# EAGLE design AC-DC (EAGLE 9.5.2)
Assembly variants: NoPCB
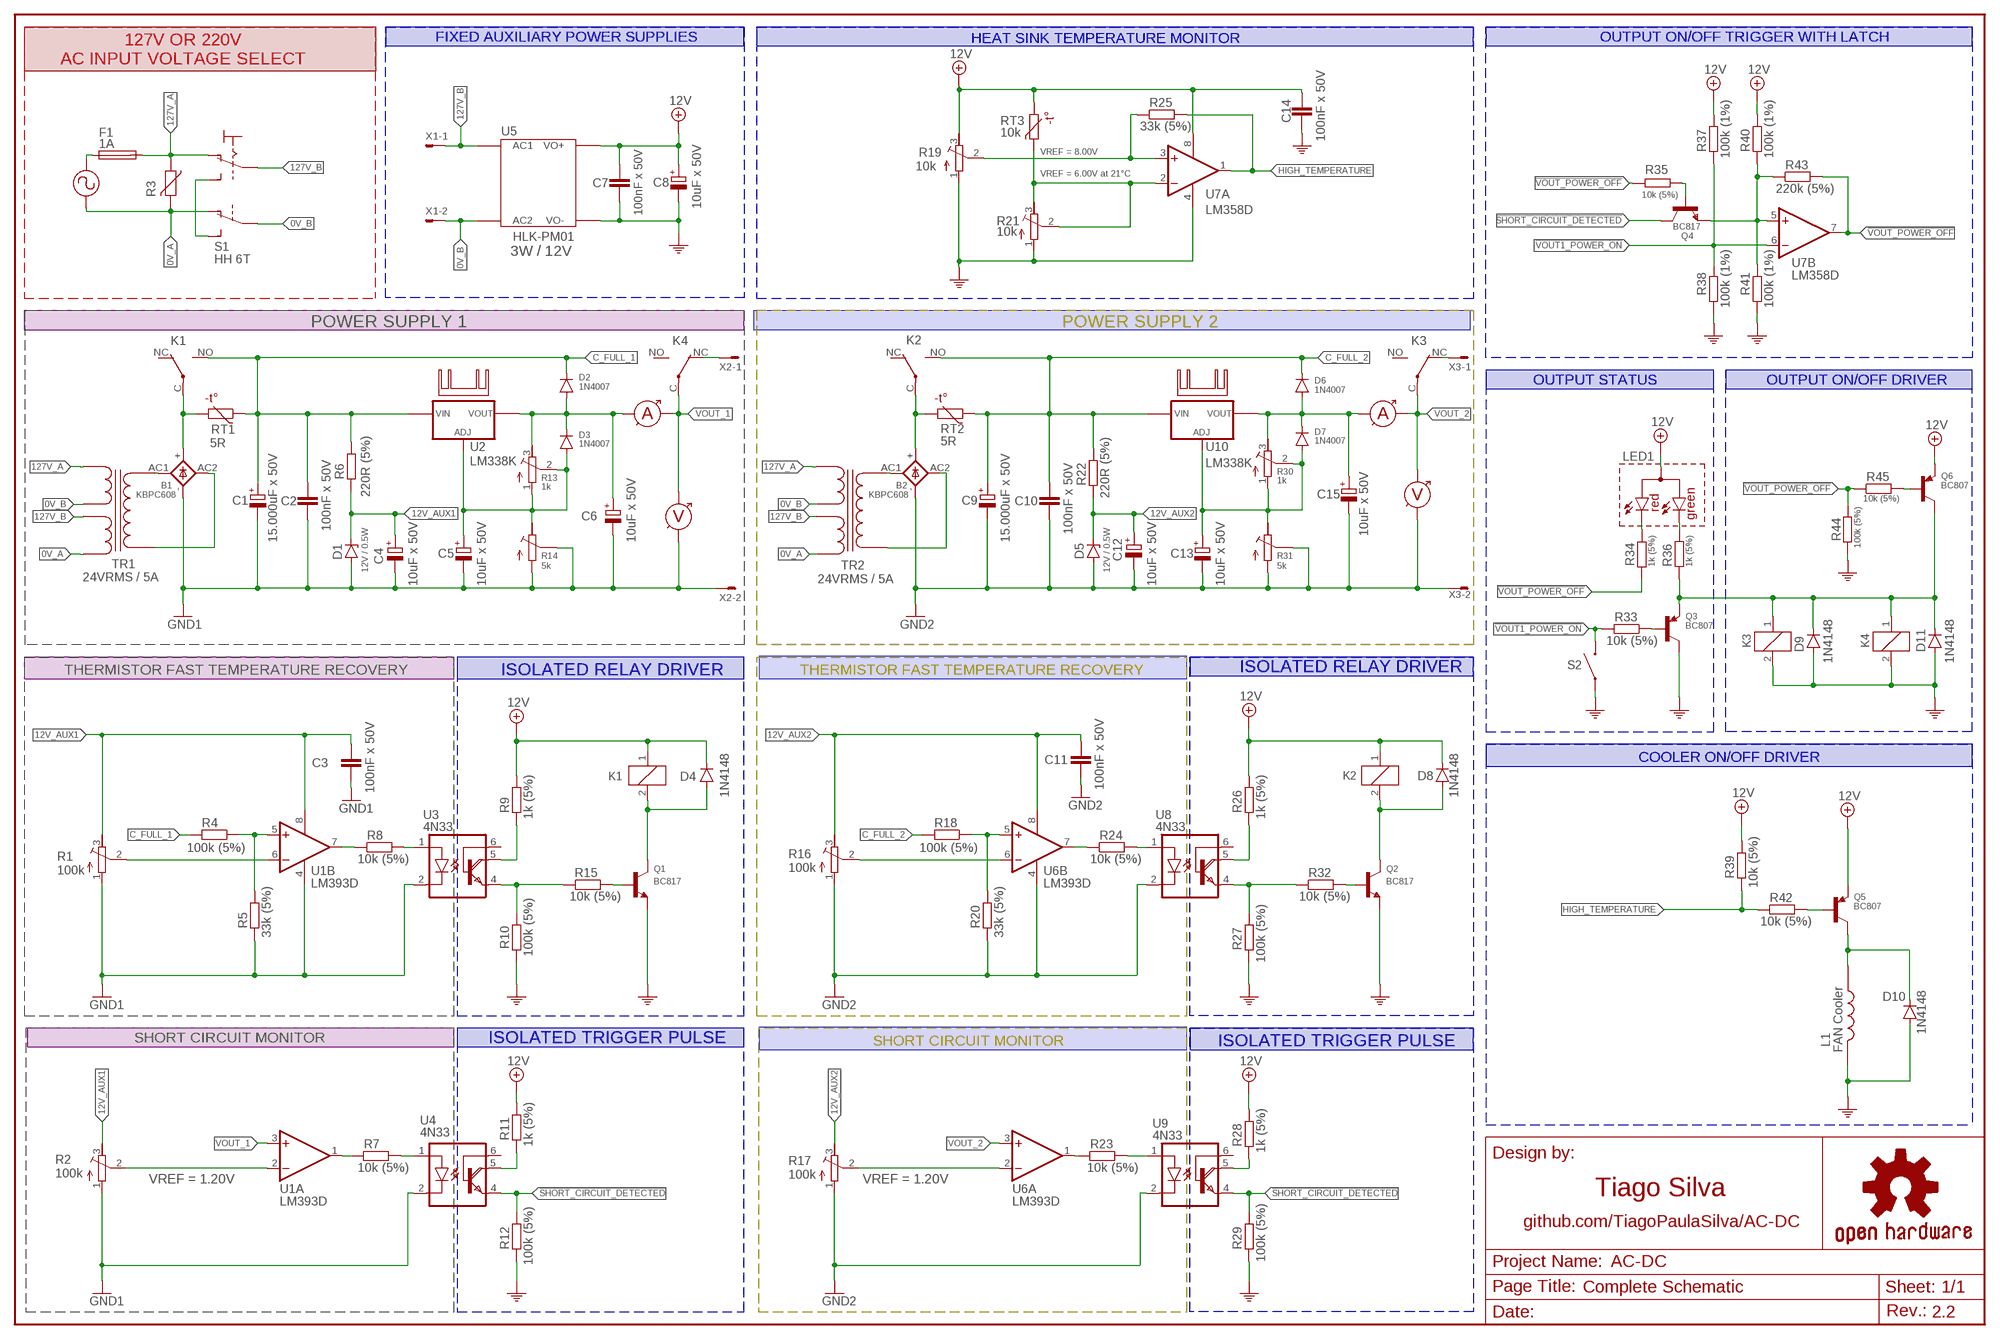
[diagram p0: schematic, sheet 1]

## Parts
AMP1  AMMETER  [AMMETER]
AMP2  AMMETER  [AMMETER]
B1  KBPC608  GBPC1  [GBPC1]
B2  KBPC608  GBPC1  [GBPC1]
C1  15.000uF x 50V  CPOL-EUE10-35  [EB35D]
C2  100nF x 50V  C-EUC0805  [C0805]
C3  100nF x 50V  C-EUC0805  [C0805]
C4  10uF x 50V  CPOL-EU153CLV-0605  [153CLV-0605]
C5  10uF x 50V  CPOL-EU153CLV-0605  [153CLV-0605]
C6  10uF x 50V  CPOL-EU153CLV-0605  [153CLV-0605]
C7  100nF x 50V  C-EUC0805  [C0805]
C8  10uF x 50V  CPOL-EU153CLV-0605  [153CLV-0605]
C9  15.000uF x 50V  CPOL-EUE10-35  [EB35D]
C10  100nF x 50V  C-EUC0805  [C0805]
C11  100nF x 50V  C-EUC0805  [C0805]
C12  10uF x 50V  CPOL-EU153CLV-0605  [153CLV-0605]
C13  10uF x 50V  CPOL-EU153CLV-0605  [153CLV-0605]
C14  100nF x 50V  C-EUC0805  [C0805]
C15  10uF x 50V  CPOL-EU153CLV-0605  [153CLV-0605]
D1  12V / 0.5W  ZENER-DIODESOD80C  [SOD80C]
D2  1N4007  CGRM4007-G  [SOD-123_MINI-SMA]
D3  1N4007  CGRM4007-G  [SOD-123_MINI-SMA]
D4  1N4148  DIODE-SOD80C  [SOD80C]
D5  12V / 0.5W  ZENER-DIODESOD80C  [SOD80C]
D6  1N4007  CGRM4007-G  [SOD-123_MINI-SMA]
D7  1N4007  CGRM4007-G  [SOD-123_MINI-SMA]
D8  1N4148  DIODE-SOD80C  [SOD80C]
D9  1N4148  DIODE-SOD80C  [SOD80C]
D10  1N4148  DIODE-SOD80C  [SOD80C]
D11  1N4148  DIODE-SOD80C  [SOD80C]
F1  1A  FUSE  (no package)
G1  GENERATOR  (no package)
K1  CQ1-12V  [CQ1]
K2  CQ1-12V  [CQ1]
K3  CQ1-12V  [CQ1]
K4  CQ1-12V  [CQ1]
L1  FAN Cooler  MOTOR  [MOLEX-2P]
LED1  LED-BICOLOR-MOLEX3P  [MOLEX3P]
Q1  BC817  BC848SMD  [SOT23]
Q2  BC817  BC848SMD  [SOT23]
Q3  BC807  BC858BSMD  [SOT23-BEC]
Q4  BC817  BC848BSMD  [SOT23]
Q5  BC807  BC858BSMD  [SOT23-BEC]
Q6  BC807  BC858BSMD  [SOT23-BEC]
R1  100k  R-TRIMM3202  [RTRIM3202]
R2  100k  R-TRIMM3202  [RTRIM3202]
R3  VARISTOR  (no package)
R4  100k (5%)  R-EU_R0805  [R0805]
R5  33k (5%)  R-EU_R0805  [R0805]
R6  220R (5%)  R-EU_R2512  [R2512]
R7  10k (5%)  R-EU_R0805  [R0805]
R8  10k (5%)  R-EU_R0805  [R0805]
R9  1k (5%)  R-EU_R0805  [R0805]
R10  100k (5%)  R-EU_R0805  [R0805]
R11  1k (5%)  R-EU_R0805  [R0805]
R12  100k (5%)  R-EU_R0805  [R0805]
R13  1k  R-TRIMM3202  [RTRIM3202]
R14  5k  R-TRIMM  [MOLEX3P]
R15  10k (5%)  R-EU_R0805  [R0805]
R16  100k  R-TRIMM3202  [RTRIM3202]
R17  100k  R-TRIMM3202  [RTRIM3202]
R18  100k (5%)  R-EU_R0805  [R0805]
R19  10k  R-TRIMM3202  [RTRIM3202]
R20  33k (5%)  R-EU_R0805  [R0805]
R21  10k  R-TRIMM3202  [RTRIM3202]
R22  220R (5%)  R-EU_R2512  [R2512]
R23  10k (5%)  R-EU_R0805  [R0805]
R24  10k (5%)  R-EU_R0805  [R0805]
R25  33k (5%)  R-EU_R0805  [R0805]
R26  1k (5%)  R-EU_R0805  [R0805]
R27  100k (5%)  R-EU_R0805  [R0805]
R28  1k (5%)  R-EU_R0805  [R0805]
R29  100k (5%)  R-EU_R0805  [R0805]
R30  1k  R-TRIMM3202  [RTRIM3202]
R31  5k  R-TRIMM  [MOLEX3P]
R32  10k (5%)  R-EU_R0805  [R0805]
R33  10k (5%)  R-EU_R0805  [R0805]
R34  1k (5%)  R-EU_R0805  [R0805]
R35  10k (5%)  R-EU_R0805  [R0805]
R36  1k (5%)  R-EU_R0805  [R0805]
R37  100k (1%)  R-EU_R0805  [R0805]
R38  100k (1%)  R-EU_R0805  [R0805]
R39  10k (5%)  R-EU_R0805  [R0805]
R40  100k (1%)  R-EU_R0805  [R0805]
R41  100k (1%)  R-EU_R0805  [R0805]
R42  10k (5%)  R-EU_R0805  [R0805]
R43  220k (5%)  R-EU_R0805  [R0805]
R44  100k (5%)  R-EU_R0805  [R0805]
R45  10k (5%)  R-EU_R0805  [R0805]
RT1  5R  NTC-11MM  [11MM]
RT2  5R  NTC-11MM  [11MM]
RT3  10k  NTC-MOLEX2P  [MOLEX2P]
S1  HH 6T  320-938  (no package)
S2  SWITCH-MOLEX2P  [MOLEX-2P]
TR1  24VRMS / 5A  TRAFO  [2PINS]
TR2  24VRMS / 5A  TRAFO  [2PINS]
U1  LM393D  [SO08]
U2  LM338K  LM338K-MOLEX  [MOLEX3P]
U3  4N33  [DIL6-SMD]
U4  4N33  [DIL6-SMD]
U5  HLK-PM01  [HLK-PM01]
U6  LM393D  [SO08]
U7  LM358D  [SO08]
U8  4N33  [DIL6-SMD]
U9  4N33  [DIL6-SMD]
U10  LM338K  LM338K-MOLEX  [MOLEX3P]
VOLT1  VOLTMETER  [VOLTMETER]
VOLT2  VOLTMETER  [VOLTMETER]
X1  22-23-2021  [22-23-2021]
X2  22-23-2021  [22-23-2021]
X3  22-23-2021  [22-23-2021]

## Nets
0V_A: G1.P$2 R3.2 S1.O
0V_B: S1.P U5.P$2(AC2) X1.2
12V_AUX1: C3.1 C4.+ D1.C R1.3(E) R2.3(E) R6.1 U1.8(P:V+) VOLT1.P$1
12V_AUX2: C11.1 C12.+ D5.C R16.3(E) R17.3(E) R22.1 U6.8(P:V+) VOLT2.P$1
127V_A: F1.2 R3.1 S1.O
127V_B: S1.P U5.P$1(AC1) X1.1
!SHORT_CIRCUIT_DETECTED!: Q4.3(C) R12.2 R29.2 U4.4(E) U9.4(E)
!VOUT1_POWER_ON!: R33.2 R37.1 R38.2 S2.P$2 U7.6(B:-IN)
!VOUT1_POWER_ON!1: R11.1 U4.5(COL)
!VOUT1_POWER_ON!2: R9.1 U3.5(COL)
!VOUT1_POWER_ON!3: R28.1 U9.5(COL)
!VOUT1_POWER_ON!4: R26.1 U8.5(COL)
!VOUT_POWER_OFF!: R34.2 R35.1 R43.2 R44.1 R45.1 U7.7(B:OUT)
+12V: C7.1 C8.+ C14.1 D4.C D8.C K1.1 K2.1 LED1.P$1(A) Q5.E Q6.E R9.2 R11.2 R19.3(E) R26.2 R28.2 R37.2 R39.2 R40.2 RT3.P$2 U5.P$4(VO+) U7.8(P:V+) ; supply symbol labelled 12V
C_FULL_1: C1.+ C2.1 D2.C K1.NO(2:S) R4.2 R6.2 RT1.P$1 U2.1(VIN)
C_FULL_2: C9.+ C10.1 D6.C K2.NO(2:S) R18.2 R22.2 RT2.P$1 U10.1(VIN)
GND1: B1.- C1.- C2.2 C3.2 C4.- C5.- C6.- D1.A R1.1(A) R2.1(A) R5.1 R14.P$1(A) R14.P$3(S) U1.4(P:V-) U3.2(C) U4.2(C) VOLT1.P$2 X2.2
GND2: B2.- C9.- C10.2 C11.2 C12.- C13.- C15.- D5.A R16.1(A) R17.1(A) R20.1 R31.P$1(A) R31.P$3(S) U6.4(P:V-) U8.2(C) U9.2(C) VOLT2.P$2 X3.2
HIGH_TEMPERATURE: R25.2 R39.1 R42.1 U7.1(A:OUT)
N$1: B1.+ K1.C(2:P) RT1.P$2
N$2: D4.A K1.2 Q1.3(C)
N$3: LED1.P$3(CR) R34.1
N$4: Q1.1(B) R15.2
N$5: R17.2(S) U6.2(A:-IN)
N$6: R1.2(S) U1.6(B:-IN)
N$7: Q6.B R45.2
N$8: F1.1 G1.P$3
N$9: S1.S
N$10: B1.AC1 TR1.1
N$11: B1.AC2 TR1.2
N$12: D9.C D11.C K3.1 K4.1 Q3.E Q6.C R36.1
N$13: LED1.P$2(CG) R36.2
N$14: Q3.B R33.1
N$15: AMP1.2 C6.+ D2.A D3.C R13.3(E) U2.3(VOUT)
N$16: C5.+ D3.A R13.1(A) R13.2(S) R14.P$2(E) U2.2(GND)
N$17: K4.NC(2:O) X2.1
N$18: R4.1 R5.2 U1.5(B:+IN)
N$19: R7.1 U1.1(A:OUT)
N$20: R7.2 U4.1(A)
N$21: Q4.2(E) R40.1 R41.2 R43.1 U7.5(B:+IN)
N$22: Q4.1(B) R35.2
N$23: B2.AC1 TR2.1
N$24: B2.AC2 TR2.2
N$25: R2.2(S) U1.2(A:-IN)
N$26: AMP2.2 C15.+ D6.A D7.C R30.3(E) U10.3(VOUT)
N$27: C13.+ D7.A R30.1(A) R30.2(S) R31.P$2(E) U10.2(GND)
N$28: K3.NC(2:O) X3.1
N$29: B2.+ K2.C(2:P) RT2.P$2
N$32: Q5.B R42.2
N$33: D8.A K2.2 Q2.3(C)
N$35: R21.2(S) R21.3(E) RT3.P$1 U7.2(A:-IN)
N$36: R19.2(S) R25.1 U7.3(A:+IN)
N$37: R8.1 U1.7(B:OUT)
N$38: D10.C L1.P$1 Q5.C
N$39: R8.2 U3.1(A)
N$40: Q2.1(B) R32.2
N$41: R18.1 R20.2 U6.5(B:+IN)
N$42: R23.1 U6.1(A:OUT)
N$43: R16.2(S) U6.6(B:-IN)
N$44: R23.2 U9.1(A)
N$45: R24.1 U6.7(B:OUT)
N$46: R24.2 U8.1(A)
N$47: R27.2 R32.1 U8.4(E)
N$48: R10.2 R15.1 U3.4(E)
PE: C7.2 C8.- C14.2 D9.A D10.A D11.A K3.2 K4.2 L1.P$2 Q1.2(E) Q2.2(E) Q3.C R10.1 R12.1 R19.1(A) R21.1(A) R27.1 R29.1 R38.1 R41.1 R44.2 S2.P$1 U5.P$3(VO-) U7.4(P:V-)
VOUT_1: AMP1.1 K4.C(2:P) U1.3(A:+IN) VOLT1.P$3
VOUT_2: AMP2.1 K3.C(2:P) U6.3(A:+IN) VOLT2.P$3
Unconnected: K1.NC(2:O) K2.NC(2:O) K3.NO(2:S) K4.NO(2:S) U3.6(B) U4.6(B) U8.6(B) U9.6(B)

## Notes on the sheet
- FIXED AUXILIARY POWER SUPPLIES | OUTPUT ON/OFF TRIGGER WITH LATCH
- HEAT SINK TEMPERATURE MONITOR
- 127V OR 220V
  AC INPUT VOLTAGE SELECT
- VREF = 8.00V
- VREF = 6.00V at 21°C
- 3W / 12V
- POWER SUPPLY 1 | POWER SUPPLY 2
- OUTPUT STATUS | OUTPUT ON/OFF DRIVER
- THERMISTOR FAST TEMPERATURE RECOVERY | THERMISTOR FAST TEMPERATURE RECOVERY | ISOLATED RELAY DRIVER
- ISOLATED RELAY DRIVER
- COOLER ON/OFF DRIVER
- SHORT CIRCUIT MONITOR | SHORT CIRCUIT MONITOR
- ISOLATED TRIGGER PULSE | ISOLATED TRIGGER PULSE
- VREF = 1.20V | VREF = 1.20V
- Tiago Silva
- github.com/TiagoPaulaSilva/AC-DC
- Complete Schematic
- 2.2

## Library data of the parts
AMP1 AMP2 = Instrumentos:AMMETER
B1 B2 = rectifier:GBPC1: GENERAL INSTRUMENT RECTIFIER
C1 C4-C6 C8 C9 C12 C13 C15 = rcl:CPOL-EU: POLARIZED CAPACITOR, European symbol; SPICEPREFIX: C
C2 C3 C7 C10 C11 C14 = rcl:C-EU: CAPACITOR, European symbol; SPICEPREFIX: C
D1 D5 = diode:ZENER-DIODE: Z-Diode
D2 D3 D6 D7 = diode:CGRM400*-G: Molded plasitc,JEDEC SOD-123/Mini SMA Source: Comchip CGRM4001-G.pdf
D4 D8-D11 = diode:DIODE-: DIODE
F1 = fuse-no-footprint:FUSE: Fuse; _EXTERNAL_: _EXTERNAL_
G1 = Instrumentos:GENERATOR; _EXTERNAL_: _EXTERNAL_
K1-K4 = relay:CQ1-12V: AUTOMOTIVE QUIET RELAY NAiS Source: http://www.mew-europe.com/.. en_ds_61208_0000.pdf; OC_FARNELL: unknown; OC_NEWARK: unknown
L1 = Inductor:MOTOR
LED1 = led:LED-BICOLOR-MOLEX3P
Q1 Q2 Q4 = transistor-npn:BC848*: NPN Transistor
Q3 Q5 Q6 = transistor-pnp:BC858*: PNP Transistror
R1 R2 R13 R16 R17 R19 R21 R30 = rcl:R-TRIMM: Trimm resistor; SPICEMODEL: X; SPICEPREFIXL: POT
R3 = varistor:VARISTOR: VARISTOR; _EXTERNAL_: _EXTERNAL_
R4-R12 R15 R18 R20 R22-R29 R32-R45 = rcl:R-EU_: RESISTOR, European symbol; SPICEPREFIX: R
R14 R31 = trimpot-molex2p:R-TRIMM: Trimm resistor
RT1 RT2 = ptc-ntc:NTC-11MM
RT3 = ptc-ntc:NTC-MOLEX2P
S1 = switch-HH-NO-MODEL:320-938: TOGGLE SWITCH distributor RS Components; _EXTERNAL_: _EXTERNAL_
S2 = switch-MOLEX2:SWITCH-MOLEX2P
TR1 TR2 = Trafo:TRAFO; _EXTERNAL_: _EXTERNAL_
U1 U6 = linear:LM393: COMPARATOR
U2 U10 = REG1117:LM338K-MOLEX
U3 U4 U8 U9 = optocoupler:4N33: MOTOROLA OPTO COUPLER
U5 = HLK-PM01:HLK-PM01: HI-LINK Ultra-compact power module HLK-PM01 Meet UL, CE requirements Ultra-thin, ultra-small All voltage input (AC: 90 ~ 264V) Low ripple and low noise Output overload and short circuit protection High efficiency, high power density The product is designed to meet the requirements of EMC and Safety Test Low power consumption, environmental protection, no-load loss <0.1W 100% load aging and testing; AVAILABILITY: Unavailable; MF: Hi-link; MP: hlk-pm01; PACKAGE: Package Analog Devices; PRICE: None
U7 = linear:LM358: OP AMP also LM158; LM258; LM2904 Source: http://cache.national.com/ds/LM/LM158.pdf
VOLT1 VOLT2 = Instrumentos:VOLTMETER
X1-X3 = con-molex-PTR:22-23-2021: .100" (2.54mm) Center Header - 2 Pin; MF: MOLEX; MPN: 22-23-2021; OC_FARNELL: 1462926; OC_NEWARK: 25C3832

## Board
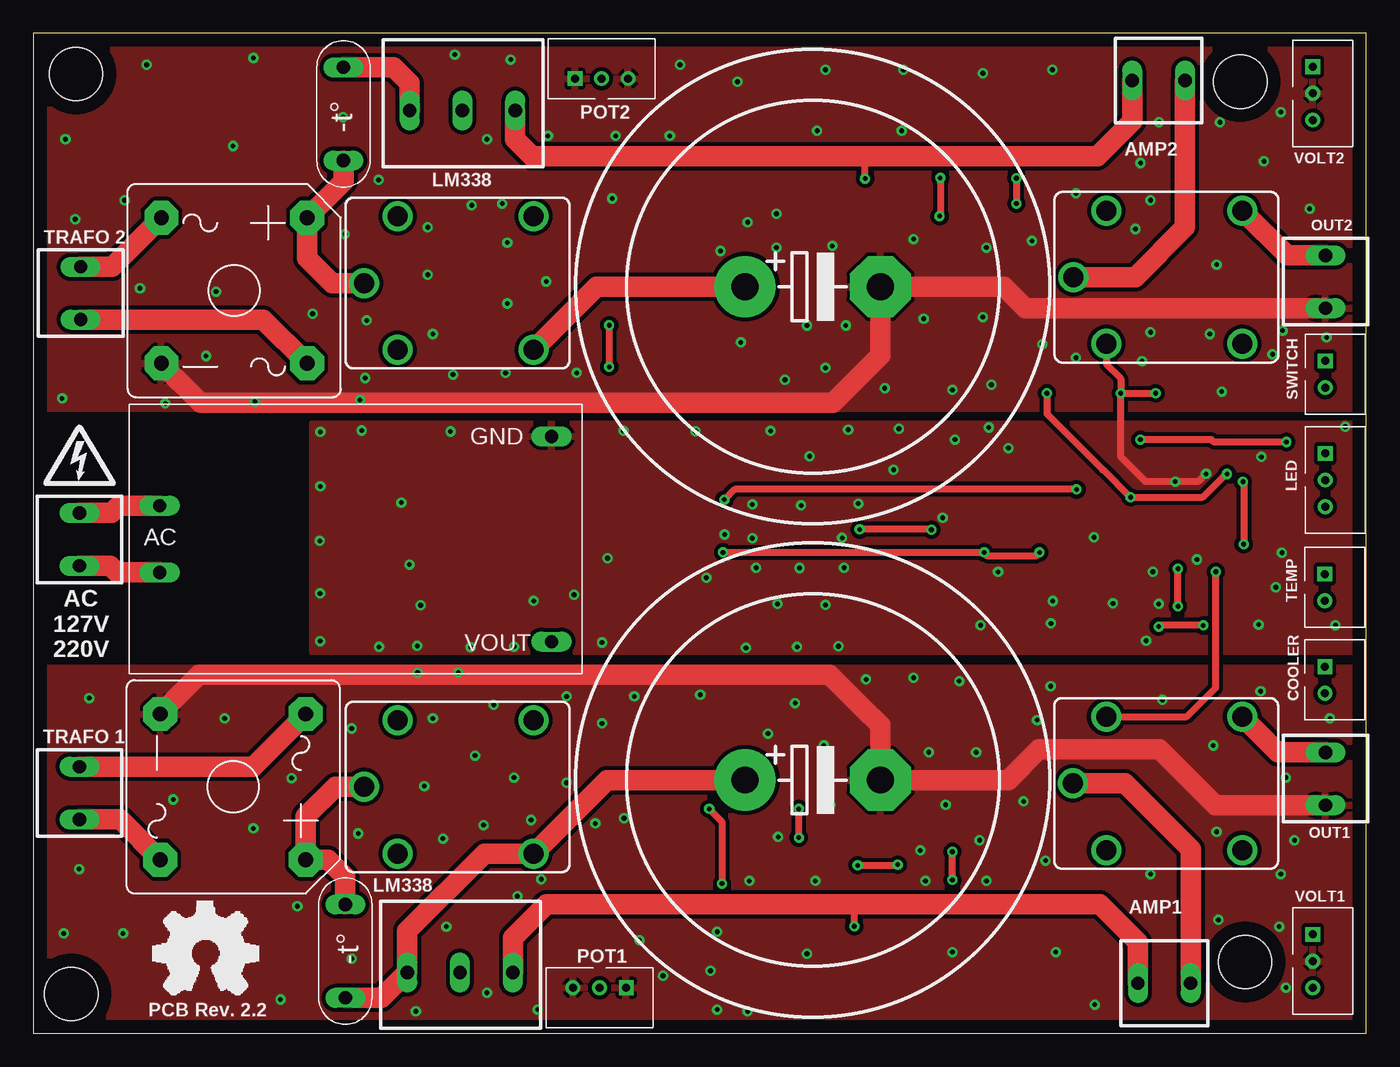
[diagram p1: board, top side]
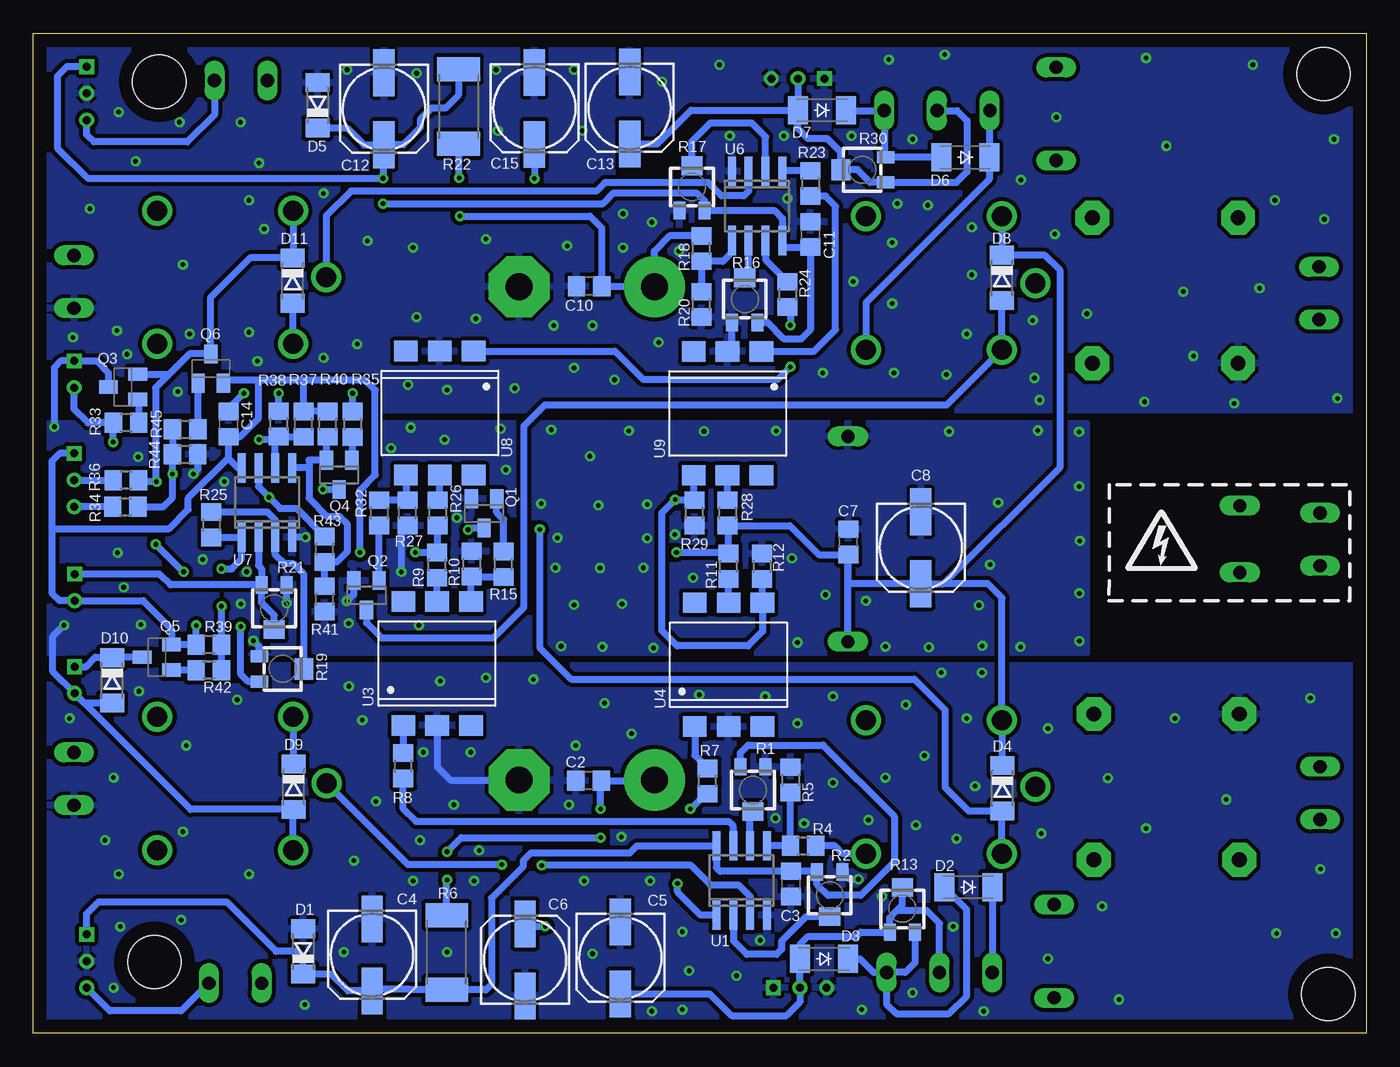
[diagram p2: board, bottom side, seen from below]

Size 100 x 75 mm. Coordinates in mm from the lower left corner, seen from the top.
Outline: 0,0 100,0 100,75 0,75 0,0
Copper layers (1*16): Top 0.035mm / dielectric 1.5mm / Bottom 0.035mm
Design rules "default *": minimum track width 20mil, minimum drill 0.35mm, track to track 12mil, track to pad 12mil, pad to pad 12mil, via to via 12mil, smd to smd 12mil, copper to edge 40mil, drill to drill 6mil, minimum pad ring 10mil, minimum via ring 8mil, stop-mask expansion 4mil, vias tented up to drill 0mil, thermal gap 10mil
Holes 4 mm at 90.55,71.37 2.84,2.95 3.2,71.96 90.91,5.36

### Footprints (pad centres in the part's own frame; a part is rotated, then mirrored left to right if it is on the bottom)
AMMETER = drill 1 long: 1 0,0; 2 3.96,0
GBPC1 = drill 1.118 pad 2.54 octagon: + 5.461,5.461; - -5.461,-5.461; AC1 -5.461,5.461; AC2 5.461,-5.461
EB35D = drill 2.007 pad 4.597: + -5.08,0 | drill 2.007 pad 4.597 octagon: - 5.08,0
C0805 = smd 1.3 x 1.5: 1 -0.95,0; 2 0.95,0
153CLV-0605 = smd 3.5 x 1.6: + 2.7,0; - -2.7,0
SOD80C = smd 1.4 x 1.8: A 1.7,0; C -1.7,0
SOD-123_MINI-SMA = smd 1.5 x 2.1: A 1.8,0; C -1.8,0
CQ1 = drill 1.5: 1 4.5,-5; 2 4.5,5; C 7,0; NC -5.7,-5; NO -5.7,5
MOLEX-2P = drill 0.6 square: P$1 0,0 | drill 0.6: P$2 2,0
MOLEX3P = drill 0.6 square: P$1 0,0 | drill 0.6: P$2 2,0; P$3 4,0
SOT23 = smd 1 x 1.4: 1 -0.95,-1.1; 2 0.95,-1.1; 3 0,1.1
SOT23-BEC = smd 1 x 1.4: B -0.95,-1.1; C 0,1.1; E 0.95,-1.1
RTRIM3202 = smd 0.9 x 1.3: 1 -0.95,-1.75; 3 0.95,-1.75 | smd 1.6 x 1.4: 2 0,1.6
R0805 = smd 1.3 x 1.5: 1 -0.95,0; 2 0.95,0
R2512 = smd 1.8 x 3.2: 1 -2.8,0; 2 2.8,0
11MM = drill 1 long: P$1 0,0; P$2 7,0
MOLEX2P = drill 0.6 square: P$1 0,0 | drill 0.6: P$2 2,0
2PINS = drill 1 long: 1 0,0; 2 3.96,0
SO08 = smd 0.6 x 2.2: 1 -1.905,-2.6; 2 -0.635,-2.6; 3 0.635,-2.6; 4 1.905,-2.6; 5 1.905,2.6; 6 0.635,2.6; 7 -0.635,2.6; 8 -1.905,2.6
MOLEX3P' = drill 1 long: 1 2.009,4.191; 2 5.969,4.191; 3 9.929,4.191
DIL6-SMD = smd 1.78 x 1.52: 1 -2.54,-4.645; 2 0,-4.645; 3 2.54,-4.645; 4 2.54,4.645; 5 0,4.645; 6 -2.54,4.645
HLK-PM01 = drill 1 long: P$1 -14.7,2.5; P$2 -14.7,-2.5; P$3 14.7,7.7; P$4 14.7,-7.7
VOLTMETER = drill 0.6 square: P$1 0,0 | drill 0.6: P$2 2,0; P$3 4,0
22-23-2021 = drill 1 long: 1 0,0; 2 3.96,0

### Placement (x,y rotation side)
AMP1  86.83,3.76 180 top
AMP2  86.41,71.45 180 top
B1  14.98,18.49 270 top
B2  15.07,55.71 0 top
C1  58.48,19 0 top
C2  58.34,18.96 180 bottom
C3  43.15,11.2 270 bottom
C4  74.59,5.88 270 bottom
C5  55.96,5.65 270 bottom
C6  63.11,5.51 90 bottom
C7  38.86,36.86 90 bottom
C8  33.41,36.42 270 bottom
C9  58.48,56 0 top
C10  58.29,56.05 180 bottom
C11  41.69,59.92 90 bottom
C12  73.7,69.34 270 bottom
C13  55.26,69.41 270 bottom
C14  85.34,45.69 90 bottom
C15  62.41,69.37 270 bottom
D1  79.74,6.15 90 bottom
D2  29.86,10.96 180 bottom
D3  40.68,5.58 180 bottom
D4  27.29,18.38 270 bottom
D5  78.68,69.61 90 bottom
D6  30.07,65.7 180 bottom
D7  40.84,69.23 180 bottom
D8  27.33,56.65 270 bottom
D9  80.45,18.49 270 bottom
D10  94.09,26.47 270 bottom
D11  80.53,56.45 270 bottom
K1  31.83,18.49 180 top
K2  31.83,56.27 180 top
K3  85.02,56.71 180 top
K4  84.99,18.75 180 top
L1  96.91,27.5 270 top
LED1  96.92,43.49 270 top
Q1  66.18,38.99 180 bottom
Q2  75.01,32.85 180 bottom
Q3  93.27,48.48 90 bottom
Q4  77.05,41.88 180 bottom
Q5  90.73,28.21 90 bottom
Q6  86.68,49.86 0 bottom
R1  46.01,18.25 180 bottom
R2  40.25,10.35 180 bottom
R4  42.24,14.06 0 bottom
R5  43.18,19.01 270 bottom
R6  68.99,6.06 90 bottom
R7  49.4,18.92 90 bottom
R8  72.24,20.07 90 bottom
R9  69.7,35.12 90 bottom
R10  67.12,35.2 270 bottom
R11  47.83,35.03 90 bottom
R12  45.34,35.03 270 bottom
R13  34.8,9.33 0 bottom
R14  44.48,3.42 180 top
R15  64.71,35.18 90 bottom
R16  46.62,55.07 0 bottom
R17  50.58,63.47 0 bottom
R18  49.87,58.85 90 bottom
R19  81.29,27.33 270 bottom
R20  49.87,54.67 90 bottom
R21  81.93,31.88 180 bottom
R22  68.1,69.52 270 bottom
R23  41.69,63.74 270 bottom
R24  43.41,55.42 270 bottom
R25  86.64,38.14 270 bottom
R26  69.68,39.03 270 bottom
R27  71.92,39.03 90 bottom
R28  47.92,39.03 270 bottom
R29  50.41,39.03 90 bottom
R30  37.81,64.77 90 bottom
R31  40.64,71.61 0 top
R32  74.05,39.03 270 bottom
R33  93.04,45.78 180 bottom
R34  93.09,39.48 0 bottom
R35  76.05,45.68 270 bottom
R36  93.05,41.47 180 bottom
R37  79.72,45.69 90 bottom
R38  81.58,45.71 270 bottom
R39  86.83,29.16 180 bottom
R40  77.9,45.69 90 bottom
R41  78.13,32.58 90 bottom
R42  86.83,27.23 180 bottom
R43  78.13,36.31 90 bottom
R44  88.62,43.42 0 bottom
R45  88.61,45.3 0 bottom
RT1  23.41,2.67 90 top
RT2  23.27,72.45 270 top
RT3  96.9,34.44 270 top
S2  96.93,50.43 270 top
TR1  3.46,20 270 top
TR2  3.55,57.49 270 top
U1  46.85,11.47 0 bottom
U2  LM338K  [MOLEX3P']  26.05,0.38 0 top
U3  69.7,27.74 0 bottom
U4  47.83,27.65 0 bottom
U5  24.18,37.07 0 top
U6  45.69,62.05 180 bottom
U7  82.47,39.8 0 bottom
U8  69.51,46.52 180 bottom
U9  47.92,46.49 180 bottom
U10  LM338K  [MOLEX3P']  26.23,65.01 0 top
VOLT1  96,7.42 270 top
VOLT2  96,72.5 270 top
X1  3.47,39.03 270 top
X2  96.95,21.07 270 top
X3  96.95,58.35 270 top

### Tracks (layer width: path | path; a pad name or v marks a point on that pad's centre or on a via)
0V_B
  Top 1.524: X1.2 5.78,35.07 6.27,34.57 U5.P$2
12V_AUX1
  Bottom 0.508: R1.3 46.96,21.03 46.38,21.61 40.74,21.61 35.41,16.28 35.41,12.85 37.92,10.34 40.37,10.34 41.2,11.16 R2.3 41.25,12.15 C3.1 48.47,12.15 48.76,12.43 U1.8 54.71,14.07 55.24,13.54 62.66,13.54 63.22,12.98 63.22,12.55 65.63,10.13 65.63,3.67 66.05,3.26 R6.1 71.77,3.26 71.82,3.3 74.54,3.3 74.59,3.26 C4.+ 76.39,3.18 77.66,4.45 D1.C 79.74,5.73 80.16,6.15 81.79,6.15 85.5,9.86 95.1,9.86 96,8.95 VOLT1.P$1
12V_AUX2  (via drill 0.35)
  Top 0.508: v73.76,64.14 v73.76,62.23
  Bottom 0.508: D5.C 76.47,67.91 75.2,66.64 C12.+ | R22.1 68.1,70.36 69.06,69.39 70.13,69.39 70.97,68.56 70.97,67.92 72.25,66.64 C12.+ | R16.3 44.92,53.32 43.67,52.07 42.39,52.07 41.69,52.77 C11.1 43.79,58.97 U6.8 43.79,61.11 44.4,61.73 R17.3 49.63,62.43 50.2,62.99 56.49,62.99 57.25,62.23 v73.76,62.23 | C12.+ 73.76,66.58 v73.76,64.14 95.94,64.14 98.2,66.4 98.2,71.78 97.48,72.5 VOLT2.P$1
127V_B
  Top 1.524: X1.1 5.87,39.03 6.41,39.57 U5.P$1
!SHORT_CIRCUIT_DETECTED!  (via drill 0.35)
  Top 0.508: v78.27,40.79 52.61,40.79 v51.84,40.03
  Bottom 0.508: R12.2 45.29,34.03 U4.4 45.29,30.15 46.38,29.06 51.69,29.06 52.83,30.2 52.83,39.04 v51.84,40.03 50.46,40.03 | U9.4 50.46,40.03 | 50.46,40.03 R29.2 | Q4.3 v78.26,40.78 v78.27,40.79
!VOUT1_POWER_ON!  (via drill 0.35)
  Top 0.508: v94,44.35 88.57,44.35 88.39,44.53 v83.06,44.53
  Bottom 0.508: U7.6 81.84,44.5 R38.2 | R38.2 81.57,44.74 R37.1 | S2.P$2 96.93,46.82 95.9,45.78 R33.2 94,45.77 v94,44.35 | R38.2 81.82,44.53 v83.06,44.53
!VOUT1_POWER_ON!1
  Bottom 0.508: U4.5 R11.1
!VOUT1_POWER_ON!2
  Bottom 0.508: U3.5 R9.1
!VOUT1_POWER_ON!3
  Bottom 0.508: R28.1 U9.5
!VOUT1_POWER_ON!4
  Bottom 0.508: R26.1 69.51,40.16 U8.5
!VOUT_POWER_OFF!  (via drill 0.35)
  Top 0.508: v76.05,48 76.05,46.45 80.23,42.27 80.26,42.27 v82.32,40.21 87.76,40.21 89.56,42.01 v89.56,41.95
  Bottom 0.508: R45.1 89.56,43.43 | 89.56,43.43 R44.1 | R34.2 90.26,39.48 89.56,40.19 v89.56,41.95 89.56,43.43 | R43.2 80.24,39.37 81.48,39.37 v82.32,40.21 83.11,41 U7.7 | R35.1 v76.05,48
+12V  (via drill 0.35)
  Top 0.508: v87.77,30.59 84.54,30.59 84.45,30.5 v84.43,30.5 | v75.49,36.07 75.21,35.79 71.62,35.79 v71.34,36.07 v51.74,36.07
  Bottom 0.508: D4.C 27.29,23.45 K1.1 27.33,32.66 28.39,33.72 31.71,33.72 | K2.1 D8.C 24.09,58.35 22.96,57.23 22.96,42.47 31.71,33.72 | C7.1 38.86,33.72 C8.+ 31.71,33.72 | U5.P$4 38.88,35.89 C7.1 | C7.1 41.06,35.91 43.23,38.08 R28.2 47.83,37.99 R11.2 47.93,36.08 v51.73,36.08 v51.74,36.07 | R9.2 | R26.2 69.69,36.08 R9.2 | v87.77,30.59 87.85,30.52 87.78,30.45 R39.2 Q5.E 89.63,30.32 91.75,32.44 RT3.P$2 98.03,32.44 98.6,33.02 98.6,37.64 | U7.8 84.66,42.4 85.34,43.09 85.34,43.18 | 85.34,43.18 C14.1 84.49,44.74 83.11,46.13 83.11,49.01 | R40.2 R37.2 79.72,49.01 | R19.3 83.88,26.38 84.43,26.93 v84.43,30.5 | LED1.P$1 98.03,43.49 98.6,42.92 98.6,37.64 | v75.49,36.07 75.49,40.74 74.35,41.88 74.35,48.23 75.12,49.01 79.72,49.01 | v71.34,36.07 R9.2 | 98.6,37.64 98.4,37.85 89.81,37.85 88.37,39.29 88.37,40.16 85.34,43.18 | Q6.E 85.47,49.01 83.11,49.01 | 83.11,49.01 79.72,49.01
C_FULL_1  (via drill 0.35)
  Top 0.508: v68.96,11.51 v68.96,13.61 | v57.43,14.68 v57.43,16.84
  Top 1.524: C1.+ 43.04,19 K1.NO 33.84,13.49 28.06,7.7 U2.1 26.15,2.67 RT1.P$1
  Bottom 0.508: D2.C U2.1 | K1.NO 39.28,13.49 39.85,14.06 R4.2 | C1.+ 53.44,18.96 C2.1 57.43,18.93 v57.43,16.84 | R6.2 68.99,11.48 v68.96,11.51 | v68.96,13.61 67.89,14.68 v57.43,14.68
C_FULL_2  (via drill 0.35)
  Top 0.508: v68.05,64.16 68.05,61.34 v68,61.29
  Top 1.524: K2.NO 41.08,54.83 42.25,56 44.7,56 C9.+ | RT2.P$1 27.03,72.45 28.23,71.25 U10.1
  Bottom 0.508: R18.2 49.91,59.84 52.22,59.84 53.4,58.66 C9.+ 53.45,56.05 C10.1 57.34,60.39 58.24,61.29 v68,61.29 | v68.05,64.16 68.05,66.67 R22.2 | K2.NO 37.53,54.8 28.27,64.06 D6.C 28.23,65.74 U10.1
GND1  (via drill 0.35)
  Top 1.524: X2.2 88.68,17.11 84.5,21.3 75.46,21.3 73.16,19 71.12,19 C1.- 63.56,23.09 62.22,24.43 59.74,26.91 49.58,26.91 42.67,26.91 12.45,26.91 9.52,23.98 B1.-
  Bottom 0.508: U3.2 69.7,19.99 68.7,19 C1.- | R2.1 38.75,11.56 v38.1,11.56
  other vias: 28.83,27.05 31.88,27.05 29.97,23.62 29.34,18.54 30.73,14.61 33.15,20.83 34.54,24.64 36.07,19.18 33.78,15.62 42.67,23.24 40.01,25.27 45.09,25.27 50.04,25.4 57.15,24.77 62.48,26.54 55.12,22.48 59.31,21.59 66.04,26.67 69.47,26.42 76.33,26.04 74.3,17.4 68.45,17.14 59.82,17.14 55.88,14.73 53.72,11.43 44.32,16.13 51.31,7.62 47.24,4.32 50.8,4.7 58.04,5.97 68.96,6.1 76.71,6.1 79.63,2.16 83.82,11.94 75.95,12.95 88.77,15.11 94.61,14.48 93.47,8 93.98,3.43 88.9,8.51 88.52,21.59 93.98,19.18 92.08,25.65 97.28,23.62 84.71,25.02 75.31,23.5 67.18,21.08 70.74,21.08 66.93,11.43 66.55,13.72 70.99,14.48 71.5,11.43 37.34,16 40.01,18.8 42.16,15.75 37.85,1.78 34.04,3.05 28.7,1.65 23.88,5.59 18.54,2.54 19.81,9.53 24.38,14.99 16.51,15.37 19.38,19.14 23.88,22.86 14.35,23.62 4.19,25.15 10.5,17.54 3.43,12.32 2.29,7.49 6.73,7.49 58.67,11.43 93.6,11.94 51.31,1.78 53.59,1.65 30.99,8 36.32,10.29 45.47,6.99
  pour Top: -0.13,-0.13 -0.13,27.43 100.08,27.43 100.08,-0.13
  pour Bottom: 0,0 0,27.56 100.2,27.56 100.2,0
GND2  (via drill 0.35)
  Top 1.524: B2.- 9.61,50.22 12.54,47.29 34.54,47.29 52.83,47.29 60.01,47.29 63.56,50.84 C9.- 72.82,56 74.43,54.39 X3.2
  Bottom 0.508: U9.2 47.57,51.48 R16.1
  other vias: 2.16,47.62 9.91,47.24 16.64,47.37 24.51,47.5 12.95,50.8 24.89,49.15 25.02,53.47 31.5,49.4 29.97,52.45 29.59,56.9 29.59,60.45 35.56,54.74 35.43,49.53 40.77,49.53 38.48,56.39 35.18,62.23 35.56,59.31 23.37,59.94 25.91,64.01 20.95,53.98 13.72,55.63 8,55.88 3.15,61.06 6.86,62.48 2.41,67.06 8.51,72.64 16.51,73.15 14.99,66.55 23.24,68.71 31.62,73.41 35.81,73.03 48.51,72.64 53.59,60.83 55.75,61.47 55.75,58.93 51.56,58.67 56.39,49.02 59.44,49.91 63.88,48.39 68.96,48.26 71.88,48.64 66.8,53.59 71.25,53.72 75.69,51.69 78.23,50.67 83.82,52.58 83.19,50.42 88.27,52.45 93.73,52.7 92.96,50.93 97.03,52.2 89.15,48.13 53.09,51.82 58.04,53.09 60.96,53.09 59.94,59.05 66.04,59.56 71.5,58.93 74.93,59.44 83.82,62.48 82.68,60.33 83.07,65.28 84.45,68.33 71.25,72.01 76.45,72.26 65.28,72.26 59.44,72.26 65.15,67.69 58.8,67.69 52.83,71.37 47.75,67.31 38.61,67.31 34.04,67.06 32.89,62.1 88.77,57.66 95.76,61.85 92.33,65.41 93.6,69.09 89.03,68.33 78.23,62.99 43.43,62.61 43.69,67.31
  pour Top: 0,75.06 0,46.86 100.08,46.86 100.08,75.06
  pour Bottom: 0,74.93 0,46.74 100.08,46.74 100.08,74.93
HIGH_TEMPERATURE  (via drill 0.35)
  Top 0.508: v85.88,32.03 v85.88,34.84
  Bottom 0.508: R42.1 R39.1 85.88,32.15 v85.88,32.03 | R25.2 86.63,37.2 U7.1 84.38,35.58 85.11,34.84 v85.88,34.84
N$1
  Top 1.524: K1.C 22.67,18.49 20.44,16.27 B1.+ 22.13,13.03 23.41,11.75 RT1.P$2
N$2  (via drill 0.35)
  Top 0.508: v67.39,37.77 67.36,37.8 v62,37.8
  Bottom 0.508: K1.2 27.33,16.64 D4.A 29.83,16.68 31.6,18.44 31.6,24.26 33.91,26.57 59.64,26.57 62,28.93 v62,37.8 | Q1.3 67.27,37.89 v67.39,37.77
N$3
  Bottom 0.508: R34.1 LED1.P$3
N$4
  Bottom 0.508: Q1.1 65.23,39.05 64.71,38.52 R15.2
N$5
  Bottom 0.508: U6.2 45.06,67.23 46.1,68.28 49.2,68.28 50.58,66.89 R17.2
N$6
  Bottom 0.508: U1.6 46.22,16.45 R1.2
N$7
  Bottom 0.508: Q6.B 87.66,48.73 R45.2
N$10
  Top 1.524: TR1.1 16.5,20 B1.AC1
N$11
  Top 1.524: TR1.2 6.51,16.04 B1.AC2
N$12  (via drill 0.35)
  Top 0.508: v90.75,41.36 90.81,41.31 v90.81,36.68 | K4.1 86.54,23.75 88.71,25.92 88.71,34.6 v88.72,34.62
  Bottom 0.508: K4.1 80.49,20.23 D9.C | K3.1 80.52,58.16 D11.C 83.74,58.15 86.68,55.22 Q6.C 88.28,50.96 89.81,49.43 | v88.72,34.62 88.74,34.62 v90.81,36.68 | 89.81,49.43 90.83,48.41 90.83,41.44 v90.75,41.36 92,41.36 R36.1 | Q3.E 89.81,49.43
N$13
  Bottom 0.508: LED1.P$2 94.03,41.49 R36.2
N$14
  Bottom 0.508: Q3.B 92.09,47.45 R33.1
N$15  (via drill 0.35)
  Top 0.508: v61.59,8.03 61.59,9.54 61.75,9.69
  Top 1.524: AMP1.2 82.87,6.83 80.01,9.69 61.75,9.69 55.27,9.69 38.51,9.69 35.98,7.15 U2.3
  Bottom 0.508: U2.3 35.98,2.19 35.26,1.47 31.29,1.47 29.97,2.79 29.97,9.27 D2.A | U2.3 36.96,4.57 37.96,5.58 D3.C | R13.3 33.85,5.31 34.58,4.57 U2.3 | C6.+ 63.11,8.03 v61.59,8.03
N$16
  Bottom 0.508: U2.2 32.02,8.24 32.97,9.2 35.23,9.2 | C5.+ 49.26,2.95 47.62,1.32 43.51,1.32 42.48,2.35 R14.P$2 D3.A 42.48,6.67 41.88,7.26 38.23,7.26 37.91,7.58 R13.1 35.75,8.68 35.23,9.2 | 35.23,9.2 34.8,9.63 R13.2
N$17
  Top 1.524: X2.1 93.37,21.07 K4.NC
N$18
  Bottom 0.508: U1.5 R4.1 R5.2
N$19  (via drill 0.35)
  Top 0.508: v50.71,16.84 51.66,15.88 v51.66,11.23
  Bottom 0.508: U1.1 49.94,8.87 51.66,10.59 v51.66,11.23 | R7.1 49.54,17.97 50.71,16.8 v50.71,16.84
N$20
  Bottom 0.508: U4.1 50.37,20.84 R7.2
N$21
  Bottom 0.508: R40.1 78,44.65 Q4.2 79.32,42.98 79.32,42.43 | 79.32,42.43 80.55,42.43 U7.5 | R41.2 R43.1 77.21,35.36 76.43,36.14 76.43,38.18 77.01,38.76 77.95,38.76 79.32,40.13 79.32,42.43
N$22
  Bottom 0.508: Q4.1 76.05,43.04 R35.2
N$23
  Top 1.524: B2.AC1 5.93,57.49 TR2.1
N$24
  Top 1.524: TR2.2 17.25,53.53 B2.AC2
N$25
  Bottom 0.508: U1.2 47.48,6.95 46.46,5.92 44.23,5.92 43.86,6.29 43.86,6.92 42.02,8.75 R2.2
N$26  (via drill 0.35)
  Top 0.508: v62.41,64.11 62.41,65.63 62.26,65.79
  Top 1.524: AMP2.2 82.45,68.4 79.83,65.79 62.26,65.79 37.44,65.79 36.15,67.07 U10.3
  Bottom 0.508: D7.C 39.02,69.2 U10.3 36.15,65.82 R30.3 36.03,65.7 D6.A | C15.+ v62.41,64.11
N$27
  Bottom 0.508: R31.P$2 D7.A | D7.A 42.64,67.86 41.88,67.11 40.44,67.11 39.41,66.08 R30.2 38.16,64.77 37.21,63.82 R30.1 36.05,63.83 30.73,63.83 29.95,64.62 29.95,68.45 30.7,69.2 U10.2 | C13.+ 53.17,66.71 50.65,69.23 D7.A
N$28
  Top 1.524: X3.1 94.08,58.35 K3.NC
N$29
  Top 1.524: K2.C 22.4,56.27 20.53,58.14 B2.+ 23.27,63.91 RT2.P$2
N$32
  Bottom 0.508: R42.2 89.6,27.23 Q5.B
N$33
  Bottom 0.508: D8.A K2.2 31.46,47.14 61.62,47.14 63.2,45.57 63.2,31.95 65.48,29.67 73.88,29.67 75.01,30.79 Q2.3
N$35
  Bottom 0.508: R21.2 81.93,31.34 82.88,32.29 R21.3 | RT3.P$1 90.53,34.44 89.71,33.63 R21.3 | U7.2 83.11,35.08 82.88,34.85 R21.3
N$36
  Bottom 0.508: R25.1 82.42,39.09 81.84,38.51 U7.3 81.84,35.89 81.15,35.2 80.47,35.2 79.69,34.43 R19.2
N$37
  Bottom 0.508: U1.7 47.48,15.55 47.83,15.9 71.3,15.9 72.24,16.84 R8.1
N$38
  Bottom 0.508: Q5.C 94.05,28.21 | 94.05,28.21 D10.C | L1.P$1 96.04,27.5 95.34,28.21 94.05,28.21
N$39
  Bottom 0.508: U3.1 R8.2
N$40
  Bottom 0.508: Q2.1 R32.2
N$41
  Bottom 0.508: U6.5 47.6,58.56 48.26,57.9 R18.1 R20.2
N$42
  Bottom 0.508: R23.1 43.75,64.69 U6.1
N$43
  Bottom 0.508: R16.2 46.33,56.96 U6.6
N$44
  Bottom 0.508: U9.1 41.44,51.14 39.8,52.78 39.8,62.03 40.57,62.79 R23.2
N$45
  Bottom 0.508: U6.7 45.06,58.02 R24.1
N$46  (via drill 0.35)
  Top 0.508: v43.2,53.11 v43.2,49.99
  Bottom 0.508: U8.1 56.37,51.16 54.25,49.05 44.15,49.05 v43.2,49.99 | R24.2 43.2,54.27 v43.2,53.11
N$47
  Bottom 0.508: U8.4 72.05,40.1 R27.2 R32.1
N$48
  Bottom 0.508: U3.4 67.16,34.22 R10.2 67.09,34.23 R15.1
PE  (via drill 0.35)
  Top 0.508: v81.58,48.01 v84.2,48.01 | K3.2 80.52,50.18 81.58,49.12 v81.58,48.01 | v87.99,41.96 87.4,41.38 v85.67,41.38 83.46,41.38 81.58,43.26 v81.58,48.01
  Bottom 0.508: K4.2 80.49,16.75 D9.A 88.2,16.79 L1.P$2 | K3.2 80.52,54.74 D11.A | R27.1 72.39,37.61 v72.39,34.61 | v76.48,32.42 76.45,32.42 75.96,32.91 Q2.2 | v80.99,32.24 80.99,33.62 R21.1 | v79.58,37.21 U7.4 | C14.2 85.34,46.86 v84.2,48.01 | R38.1 v81.58,48.01 | D10.A 96.17,24.77 L1.P$2 | v97.69,30.61 97.71,30.61 98.53,29.79 98.53,27.12 L1.P$2 | R19.1 83.04,28.99 v83.49,29.44 | Q3.C 94.37,49.54 95.26,50.43 S2.P$1 97.93,50.43 98.42,49.94 v98.42,45.49 | R44.2 87.67,42.28 v87.99,41.96
  other vias: 76.34,30.75 71.07,30.61 93.68,36.04 93.22,33.45 87.3,35.53 84.43,32.21 84,34.62 50.5,34.16 68.22,38.67 51.87,37.41 92.13,43.23 36.07,29.01 24.64,45.21 21.54,45.11 21.54,41.02 21.49,36.93 21.51,32.99 21.51,29.41 28.8,29.06 43.08,35.64 40.56,32.89 42.67,29.31 64.54,42.27 69.14,44.53 73.15,43.89 91.92,30.66 28.22,35.15 25.93,28.98 29.06,32.11 32.82,28.96 37.54,32.44 27.61,39.8 31.29,45.14 53.47,28.91 57.3,28.98 60.4,29.03 60.83,34.92 57.48,34.9 54.23,34.92 55.83,32.21 59.44,32.13 60.68,37.16 53.95,37.13 53.95,39.67 61.9,39.73 57.61,39.6 44.27,45.19 49.68,45.16 55.32,45.19 61.14,45.26 58.24,43.28 64.95,45.34 71.68,45.44
  pour Bottom: 100.01,28.57 20.95,28.57 20.95,45.72 100.01,45.72
  pour Top: 20.94,45.72 100.01,45.72 100.01,28.6 20.94,28.6
VOUT_1  (via drill 0.35)
  Top 0.508: v61.85,12.6 64.8,12.6 v64.85,12.65
  Top 1.524: K4.C 81.89,18.75 86.83,13.8 AMP1.1
  Bottom 0.508: U1.3 46.22,10.27 47.04,11.1 49.17,11.1 50.67,12.6 v61.85,12.6 | v64.85,12.65 71.89,12.65 K4.C | AMP1.1 88.92,1.68 94.26,1.68 VOLT1.P$3
VOUT_2
  Top 1.524: K3.C 82.67,56.71 86.41,60.45 86.41,67.87 AMP2.1
  Bottom 0.508: U6.3 46.33,63.17 46.69,62.81 48.35,62.81 49.34,63.8 57.12,63.8 57.76,63.17 76.17,63.17 78.02,61.33 K3.C | AMP2.1 86.41,68.89 88.44,66.85 95.44,66.85 96,67.41 VOLT2.P$3

### Text on the board
tPlace: POT2 | AMP2 | VOLT2 | LM338 | OUT2 | TRAFO 2 | SWITCH | LED | TEMP | AC / 127V / 220V | COOLER | TRAFO 1 | OUT1 | LM338 | VOLT1 | AMP1 | POT1 | PCB Rev. 2.2